# EAGLE schematic power_Exodia (EAGLE 9.6.2)

## Sheet 1 of 2
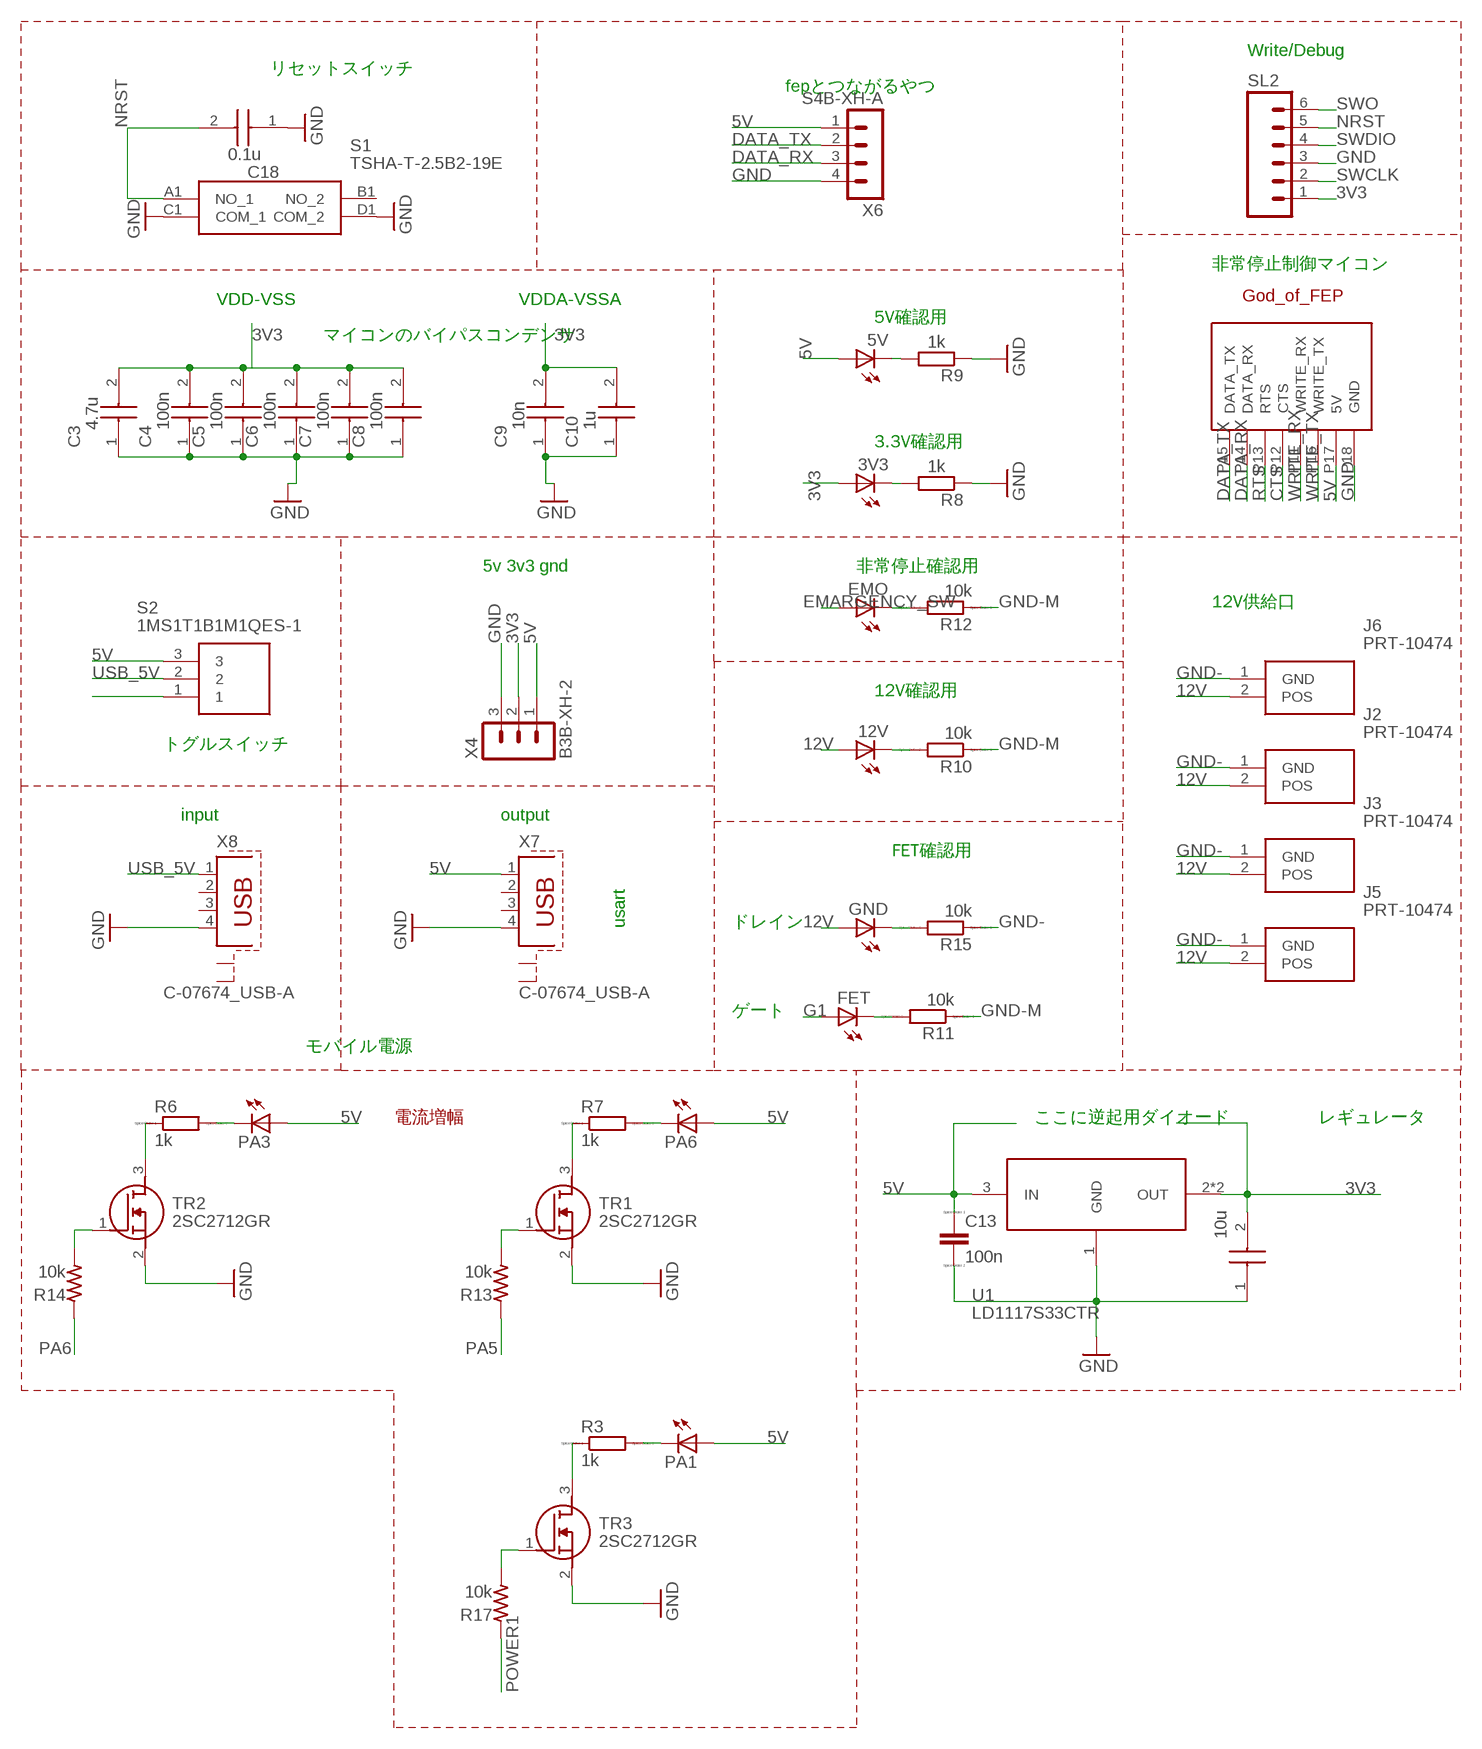
[diagram p0: schematic, sheet 1]

### Parts
3V3  LED3MM  [LED3MM]
5V  LED3MM  [LED3MM]
10U  10u  GRM188B31A106KE69D  [CAPC1608X90N]
12V  LED3MM  [LED3MM]
C3  4.7u  AMK107BBJ476MA-RE  [CAPC1709X100N]
C4  100n  AMK107BBJ476MA-RE  [CAPC1709X100N]
C5  100n  AMK107BBJ476MA-RE  [CAPC1709X100N]
C6  100n  AMK107BBJ476MA-RE  [CAPC1709X100N]
C7  100n  AMK107BBJ476MA-RE  [CAPC1709X100N]
C8  100n  AMK107BBJ476MA-RE  [CAPC1709X100N]
C9  10n  AMK107BBJ476MA-RE  [CAPC1709X100N]
C10  1u  AMK107BBJ476MA-RE  [CAPC1709X100N]
C13  100n  CC1608  [C1608]
C18  0.1u  AMK107BBJ476MA-RE  [CAPC1709X100N]
EMO  LED3MM  [LED3MM]
FEP_2  GOD_OF_FEP  [GOD_OF_FEP]
FET  LED3MM  [LED3MM]
GND  LED3MM  [LED3MM]
J2  PRT-10474  [SHDR2W320P716_1X2_1574X813X158]
J3  PRT-10474  [SHDR2W320P716_1X2_1574X813X158]
J5  PRT-10474  [SHDR2W320P716_1X2_1574X813X158]
J6  PRT-10474  [SHDR2W320P716_1X2_1574X813X158]
PA1  LED3MM  [LED3MM]
PA3  LED3MM  [LED3MM]
PA6  LED3MM  [LED3MM]
R3  1k  RR0603  [R0603]
R6  1k  RR0603  [R0603]
R7  1k  RR0603  [R0603]
R8  1k  R1608  [1608]
R9  1k  R1608  [1608]
R10  10k  RR0603  [R0603]
R11  10k  RR0603  [R0603]
R12  10k  RR0603  [R0603]
R13  10k  RESISTOR-US1608  [SMD1608]
R14  10k  RESISTOR-US1608  [SMD1608]
R15  10k  RR0603  [R0603]
R17  10k  RESISTOR-US1608  [SMD1608]
S1  TSHA-T-2.5B2-19E  [TSHAT25B219E]
S2  1MS1T1B1M1QES-1  [1MS1T1B1M1QES-1]
SL2  MA06  [06PA]
TR1  2SC2712GR  SOT-23_NMOS  [SOT-23]
TR2  2SC2712GR  SOT-23_NMOS  [SOT-23]
TR3  2SC2712GR  SOT-23_NMOS  [SOT-23]
U1  LD1117S33CTR  [SOT223]
X4  B3B-XH-2  [B3B-XH-A]
X6  S4B-XH-A  [S4B-XH-A]
X7  C-07674_USB-A  [PN87520-S]
X8  C-07674_USB-A  [PN87520-S]

### Nets
3V3: 3V3.A 10U.2 C3.2 C4.2 C5.2 C6.2 C7.2 C8.2 C9.2 C10.2 SL2.1 U1.2(OUT) U1.4(OUT) X4.2 ; also sheet 2
5V: 5V.A C13.1 FEP_2.P17(5V) PA1.A PA3.A PA6.A S2.3 U1.3(IN) X4.1 X6.1 X7.1
12V: 12V.A GND.A J2.2(POS) J3.2(POS) J5.2(POS) J6.2(POS) ; also sheet 2
CTS: FEP_2.P12(CTS)
DATA_RX: FEP_2.P14(DATA_RX) X6.3 ; also sheet 2
DATA_TX: FEP_2.P15(DATA_TX) X6.2 ; also sheet 2
EMARGENCY_SW: EMO.A ; also sheet 2
G1: FET.A ; also sheet 2
GND: 10U.1 C3.1 C4.1 C5.1 C6.1 C7.1 C8.1 C9.1 C10.1 C13.2 C18.1 FEP_2.P18(GND) R8.1 R9.1 S1.C1(COM_1) S1.D1(COM_2) SL2.3 TR1.2(S) TR2.2(S) TR3.2(S) U1.1(GND) X4.3 X6.4 X7.4 X8.4 ; also sheet 2
GND-: J2.1(GND) J3.1(GND) J5.1(GND) J6.1(GND) R15.1 ; also sheet 2
GND-M: R10.1 R11.1 R12.1 ; also sheet 2
N$1: PA6.K(C) R7.2
N$2: GND.K(C) R15.2
N$3: PA3.K(C) R6.2
N$5: R14.2 TR2.1(G)
N$7: R13.2 TR1.1(G)
N$8: 12V.K(C) R10.2
N$9: FET.K(C) R11.2
N$10: EMO.K(C) R12.2
N$12: 3V3.K(C) R8.2
N$13: 5V.K(C) R9.2
N$14: R7.1 TR1.3(D)
N$15: R6.1 TR2.3(D)
N$17: PA1.K(C) R3.2
N$18: S2.1
N$19: R17.2 TR3.1(G)
N$20: R3.1 TR3.3(D)
NRST: C18.2 S1.A1(NO_1) SL2.5 ; also sheet 2
PA5: R13.1 ; also sheet 2
PA6: R14.1 ; also sheet 2
POWER1: R17.1 ; also sheet 2
RTS: FEP_2.P13(RTS)
SWCLK: SL2.2 ; also sheet 2
SWDIO: SL2.4 ; also sheet 2
SWO: SL2.6
USB_5V: S2.2 X8.1
WRITE_RX: FEP_2.P11(WRITE_RX)
WRITE_TX: FEP_2.P16(WRITE_TX)
Unconnected: S1.B1(NO_2) X7.2 X7.3 X7.S1 X7.S2 X8.2 X8.3 X8.S1 X8.S2

### Notes on the sheet
- Write/Debug
- リセットスイッチ
- fepとつながるやつ
- 非常停止制御マイコン
- VDD-VSS | VDDA-VSSA
- 5V確認用
- マイコンのバイパスコンデンサ
- 3.3V確認用
- 5v 3v3 gnd | 非常停止確認用
- 12V供給口
- 12V確認用
- トグルスイッチ
- input | output
- FET確認用
- usart | ドレイン
- ゲート
- モバイル電源
- 電流増幅 | ここに逆起用ダイオード | レギュレータ

## Sheet 2 of 2
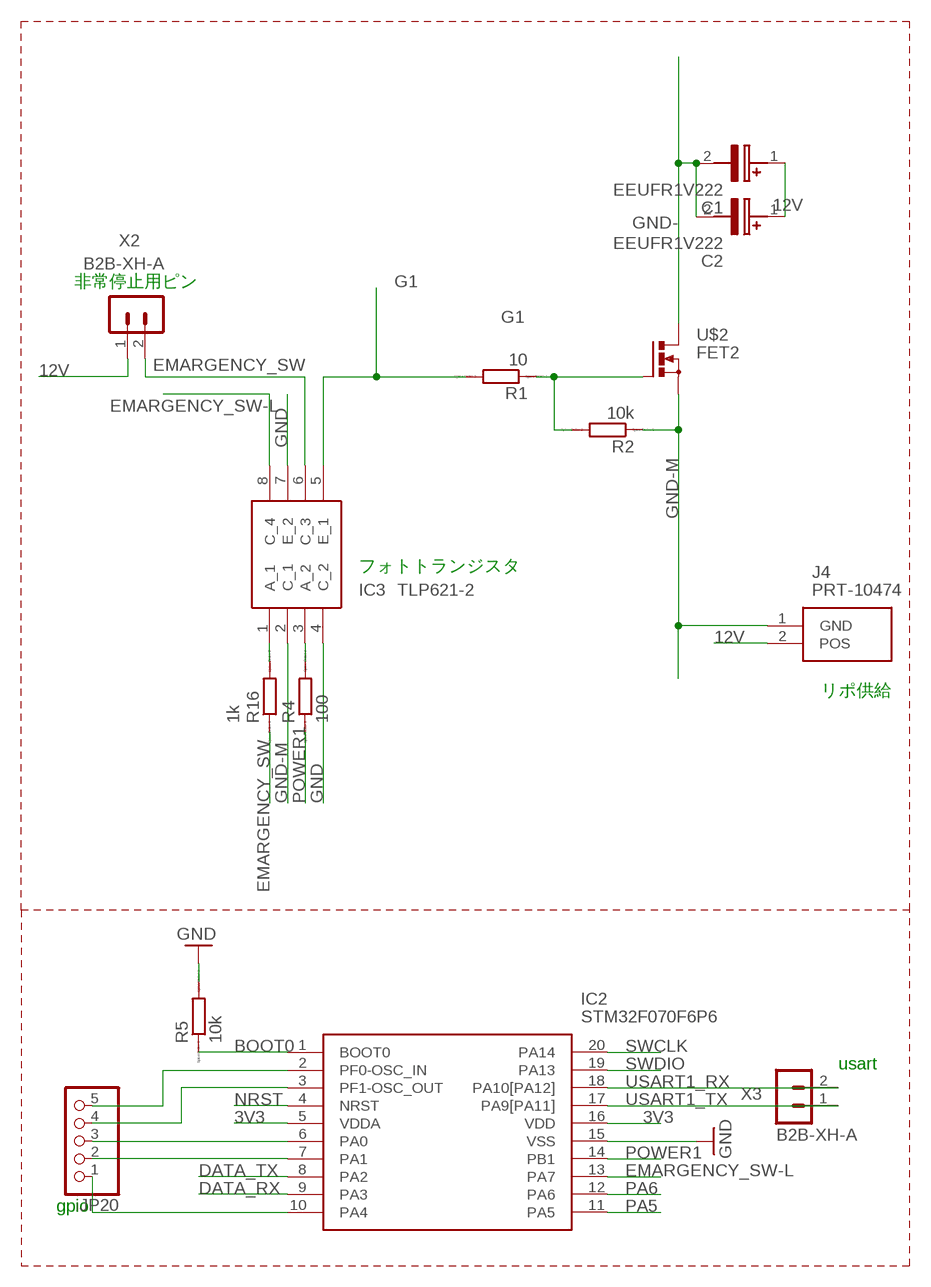
[diagram p1: schematic, sheet 2]

### Parts
C1  EEUFR1V222  [CAPPRD750W85D1600H2700]
C2  EEUFR1V222  [CAPPRD750W85D1600H2700]
IC2  STM32F070F6P6  [SOP65P640X120-20N]
IC3  TLP621-2  [DIP762W60P254L966H485Q8N]
J4  PRT-10474  [SHDR2W320P716_1X2_1574X813X158]
JP20  PINHD-1X5  [1X05]
R1  10  RR0603  [R0603]
R2  10k  RR0603  [R0603]
R4  100  RR0603  [R0603]
R5  10k  RR0603  [R0603]
R16  1k  RR0603  [R0603]
U$2  FET2  [FET2]
X2  B2B-XH-A  [B2B-XH-A]
X3  B2B-XH-A  [B2B-XH-A]

### Nets
3V3: IC2.5(VDDA) IC2.16(VDD) ; also sheet 1
12V: C1.1(+) C2.1(+) J4.2(POS) X2.1 ; also sheet 1
BOOT0: IC2.1(BOOT0) R5.1
DATA_RX: IC2.9(PA3) ; also sheet 1
DATA_TX: IC2.8(PA2) ; also sheet 1
EMARGENCY_SW: IC3.6(C_3) R16.1 X2.2 ; also sheet 1
EMARGENCY_SW-L: IC2.13(PA7) IC3.8(C_4)
G1: IC3.5(E_1) R1.2 ; also sheet 1
GND: IC2.15(VSS) IC3.4(C_2) IC3.7(E_2) R5.2 ; also sheet 1
GND-: C1.2(-) C2.2(-) U$2.D ; also sheet 1
GND-M: IC3.2(C_1) J4.1(GND) R2.1 U$2.S ; also sheet 1
N$6: IC3.3(A_2) R4.2
N$11: R1.1 R2.2 U$2.G
N$16: IC3.1(A_1) R16.2
NRST: IC2.4(NRST) ; also sheet 1
PA0: IC2.6(PA0) JP20.3
PA1: IC2.7(PA1) JP20.2
PA4: IC2.10(PA4) JP20.1
PA5: IC2.11(PA5) ; also sheet 1
PA6: IC2.12(PA6) ; also sheet 1
PF0: IC2.2(PF0-OSC_IN) JP20.5
PF1: IC2.3(PF1-OSC_OUT) JP20.4
POWER1: IC2.14(PB1) R4.1 ; also sheet 1
SWCLK: IC2.20(PA14) ; also sheet 1
SWDIO: IC2.19(PA13) ; also sheet 1
USART1_RX: IC2.18(PA10[PA12]) X3.2
USART1_TX: IC2.17(PA9[PA11]) X3.1

### Notes on the sheet
- 非常停止用ピン
- フォトトランジスタ
- リポ供給
- usart
- gpio

## Library data of the parts
3V3 5V 12V EMO FET GND PA1 PA3 PA6 = led:LED: LED OSRAM: - CHIPLED LG R971, LG N971, LY N971, LG Q971, LY Q971, LO R971, LY R971 LH N974, LH R974 LS Q976, LO Q976, LY Q976 LO Q996 - Hyper CHIPLED LW Q18S LB Q993, LB Q99A, LB R99A - SideLED LS A670, LO A670, LY A670, LG A670, LP A670 LB A673, LV A673, LT A673, LW A673 LH A674 LY A675 LS A676, LA A676, LO A676, LY A676, LW A676 LS A679, LY A679, LG A679 - Hyper Micro SIDELED® LS Y876, LA Y876, LO Y876, LY Y876 LT Y87S - SmartLED LW L88C, LW L88S LB L89C, LB L89S, LG L890 LS L89K, LO L89K, LY L89K LS L896, LA L896, LO L896, LY L896 - TOPLED LS T670, LO T670, LY T670, LG T670, LP T670 LSG T670, LSP T670, LSY T670, LOP T670, LYG T670 LG T671, LOG T671, LSG T671 LB T673, LV T673, LT T673, LW T673 LH T674 LS T676, LA T676, LO T676, LY T676, LB T676, LH T676, LSB T676, LW T676 LB T67C, LV T67C, LT T67C, LS T67K, LO T67K, LY T67K, LW E67C LS E67B, LA E67B, LO E67B, LY E67B, LB E67C, LV E67C, LT E67C LW T67C LS T679, LY T679, LG T679 LS T770, LO T770, LY T770, LG T770, LP T770 LB T773, LV T773, LT T773, LW T773 LH T774 LS E675, LA E675, LY E675, LS T675 LS T776, LA T776, LO T776, LY T776, LB T776 LHGB T686 LT T68C, LB T68C - Hyper Mini TOPLED® LB M676 - Mini TOPLED Santana® LG M470 LS M47K, LO M47K, LY M47K Source: http://www.osram.convergy.de LUXEON: - LUMILED® LXK2-PW12-R00, LXK2-PW12-S00, LXK2-PW14-U00, LXK2-PW14-V00 LXK2-PM12-R00, LXK2-PM12-S00, LXK2-PM14-U00 LXK2-PE12-Q00, LXK2-PE12-R00, LXK2-PE12-S00, LXK2-PE14-T00, LXK2-PE14-U00 LXK2-PB12-K00, LXK2-PB12-L00, LXK2-PB12-M00, LXK2-PB14-N00, LXK2-PB14-P00, LXK2-PB14-Q00 LXK2-PR12-L00, LXK2-PR12-M00, LXK2-PR14-Q00, LXK2-PR14-R00 LXK2-PD12-Q00, LXK2-PD12-R00, LXK2-PD12-S00 LXK2-PH12-R00, LXK2-PH12-S00 LXK2-PL12-P00, LXK2-PL12-Q00, LXK2-PL12-R00 Source: www.luxeon.com KINGBRIGHT: KA-3528ASYC Source: www.kingbright.com
10U = SamacSys_Parts:GRM188B31A106KE69D: Murata 1608 GRM 10000nF Ceramic Multilayer Capacitor, 10 V dc, +85C, B Dielectric, +/-10% Source: Datasheet <http://www.murata.com/~/media/webrenewal/support/library/catalog/products/capacitor/mlcc/c02e.pdf>; DESCRIPTION: Murata 1608 GRM 10000nF Ceramic Multilayer Capacitor, 10 V dc, +85C, B Dielectric, +/-10%; HEIGHT: 0.9mm; MANUFACTURER_NAME: Murata Electronics; MANUFACTURER_PART_NUMBER: GRM188B31A106KE69D; RS_PART_NUMBER: 8847157P; RS_PRICE-STOCK: http://uk.rs-online.com/web/p/products/8847157P
C1 C2 = SamacSys_Parts:EEUFR1V222: Capacitor Al FR 2200uF 35V 16x25 Panasonic 2200uF 35 V dc Aluminium Electrolytic Capacitor, FR Radial Series 10000h 16 Dia. x 25mm Source: Datasheet <http://uk.rs-online.com/web/p/products/7083885>; ARROW_PART_NUMBER: EEUFR1V222; ARROW_PRICE-STOCK: https://www.arrow.com/en/products/eeufr1v222/panasonic; DESCRIPTION: Capacitor Al FR 2200uF 35V 16x25 Panasonic 2200uF 35 V dc Aluminium Electrolytic Capacitor, FR Radial Series 10000h 16 Dia. x 25mm; HEIGHT: 27mm; MANUFACTURER_NAME: Panasonic; MANUFACTURER_PART_NUMBER: EEUFR1V222
C3-C10 C18 = SamacSys_Parts:AMK107BBJ476MA-RE: 0603 (1608M) 47uF MLCC 4V dc +/-20% SMD Source: Datasheet <https://ds.yuden.co.jp/TYCOMPAS/ut/detail?pn=AMK107BBJ476MA-RE&u=M>; DESCRIPTION: 0603 (1608M) 47uF MLCC 4V dc +/-20% SMD; HEIGHT: 1mm; MANUFACTURER_NAME: TAIYO YUDEN; MANUFACTURER_PART_NUMBER: AMK107BBJ476MA-RE; MOUSER_PART_NUMBER: 963-AMK107BBJ476MARE; MOUSER_PRICE-STOCK: https://www.mouser.com/Search/Refine.aspx?Keyword=963-AMK107BBJ476MARE; RS_PART_NUMBER: 1843762P; RS_PRICE-STOCK: http://uk.rs-online.com/web/p/products/1843762P
C13 = eagle-ltspice:C: CAPACITOR, European symbol; SPICEMODEL: NONE; SPICEPREFIX: C
FEP_2 = God_of_FEP:GOD_OF_FEP
IC2 = SamacSys_Parts:STM32F070F6P6: STMICROELECTRONICS - STM32F070F6P6 - MCU, 32BIT, CORTEX-M0, 48MHZ, TSSOP-20 Source: Datasheet <http://www.st.com/content/ccc/resource/technical/document/datasheet/31/4f/10/5f/a5/32/46/42/DM00141386.pdf/files/DM00141386.pdf/jcr:content/translations/en.DM00141386.pdf>; ARROW_PART_NUMBER: STM32F070F6P6; ARROW_PRICE-STOCK: https://www.arrow.com/en/products/stm32f070f6p6/stmicroelectronics; DESCRIPTION: STMICROELECTRONICS - STM32F070F6P6 - MCU, 32BIT, CORTEX-M0, 48MHZ, TSSOP-20; HEIGHT: 1.2mm; MANUFACTURER_NAME: STMicroelectronics; MANUFACTURER_PART_NUMBER: STM32F070F6P6; MOUSER_PART_NUMBER: 511-STM32F070F6P6; MOUSER_PRICE-STOCK: https://www.mouser.co.uk/ProductDetail/STMicroelectronics/STM32F070F6P6?qs=P9Xy8ZBwTyuokU%2FA9cV10w%3D%3D
IC3 = SamacSys_Parts:TLP621-2: Transistor Output Optocouplers 55Vceo 5000Vrms 2 Channels Source: Datasheet <https://componentsearchengine.com/Datasheets/1/TLP621-2.pdf>; DESCRIPTION: Transistor Output Optocouplers 55Vceo 5000Vrms 2 Channels; HEIGHT: 4.85mm; MANUFACTURER_NAME: Toshiba; MANUFACTURER_PART_NUMBER: TLP621-2; MOUSER_PART_NUMBER: 757-TLP621-2; MOUSER_PRICE-STOCK: https://www.mouser.com/Search/Refine.aspx?Keyword=757-TLP621-2
J2-J6 = SamacSys_Parts:PRT-10474: Soldering Workstation Equipment XT60 Connectors Male/Female Pair Source: Datasheet <http://cdn.sparkfun.com/datasheets/Prototyping/xt60.pdf>; DESCRIPTION: Soldering Workstation Equipment XT60 Connectors Male/Female Pair; HEIGHT: 15.875mm; MANUFACTURER_NAME: SparkFun; MANUFACTURER_PART_NUMBER: PRT-10474; MOUSER_PART_NUMBER: 474-PRT-10474; MOUSER_PRICE-STOCK: https://www.mouser.com/Search/Refine.aspx?Keyword=474-PRT-10474
JP20 = pinhead:PINHD-1X5: PIN HEADER
R1-R7 R10-R12 R15 R16 = eagle-ltspice:R: RESISTOR, European symbol; SPICEMODEL: NONE; SPICEPREFIX: R
R8 R9 = 1608:R1608
R13 R14 R17 = generic:RESISTOR-US: Generic Registor
S1 = SamacSys_Parts:TSHA-T-2.5B2-19E: Switch Source: Datasheet <http://akizukidenshi.com/download/ds/topup/TSHA-T-2.5B2-19E.pdf>; DESCRIPTION: Switch; HEIGHT: 2.5mm; MANUFACTURER_NAME: Akizuki Denshi Tsusho; MANUFACTURER_PART_NUMBER: TSHA-T-2.5B2-19E
S2 = SamacSys_Parts:1MS1T1B1M1QES-1: Toggle Switch SPDT On-On, 5 A, Panel Mount Source: Datasheet <http://at.rs-online.com/web/p/kippschalter/0394459/?searchTerm=394-459&relevancy-data=636F3D3126696E3D4931384E525353746F636B4E756D6265724D504E266C753D656E266D6D3D6D61746368616C6C26706D3D5E283F69292852537C5253207C52532D293F5C647B337D285C73293F5B5C732D2F255>; DESCRIPTION: Toggle Switch SPDT On-On, 5 A, Panel Mount; HEIGHT: mm; MANUFACTURER_NAME: RS Components; MANUFACTURER_PART_NUMBER: 1MS1T1B1M1QES-1
SL2 = con-amp-quick:MA06: AMP QUICK CONNECTOR; OC_FARNELL: unknown; OC_NEWARK: unknown
TR1-TR3 = maya_smd:SOT-23_NMOS
U1 = LD1117S33CTR:LD1117S33CTR: http://octopart.com/ld1117s33tr-stmicroelectronics-526708; AVAILABILITY: Unavailable; DESCRIPTION: LD1117 Series 1300 mA 3.3 V Fixed Output Positive Voltage LDO Regulator- SOT-223; MF: STMicroelectronics; MP: LD1117S33CTR; PACKAGE: SOT-223 STMicroelectronics; PRICE: None
U$2 = mylbr:FET2
X2 X3 = con-JST_XH:B2B-XH: JST XH series header 2.50mm pitch disconnectable crimp style connectors, vertical (side entry type), 2 pins
X4 = con-JST_XH:B3B-XH: JST XH series header 2.50mm pitch disconnectable crimp style connectors, vertical (side entry type), 3 pins
X6 = con-JST_XH:S4B-XH: JST XH series header 2.50mm pitch disconnectable crimp style connectors, horizontal (side entry type), 4 pins
X7 X8 = Akizuki:C-07674_USB-A; OC_FARNELL: unknown; OC_NEWARK: unknown